# EAGLE design IOIO Homemade (EAGLE 5.11)
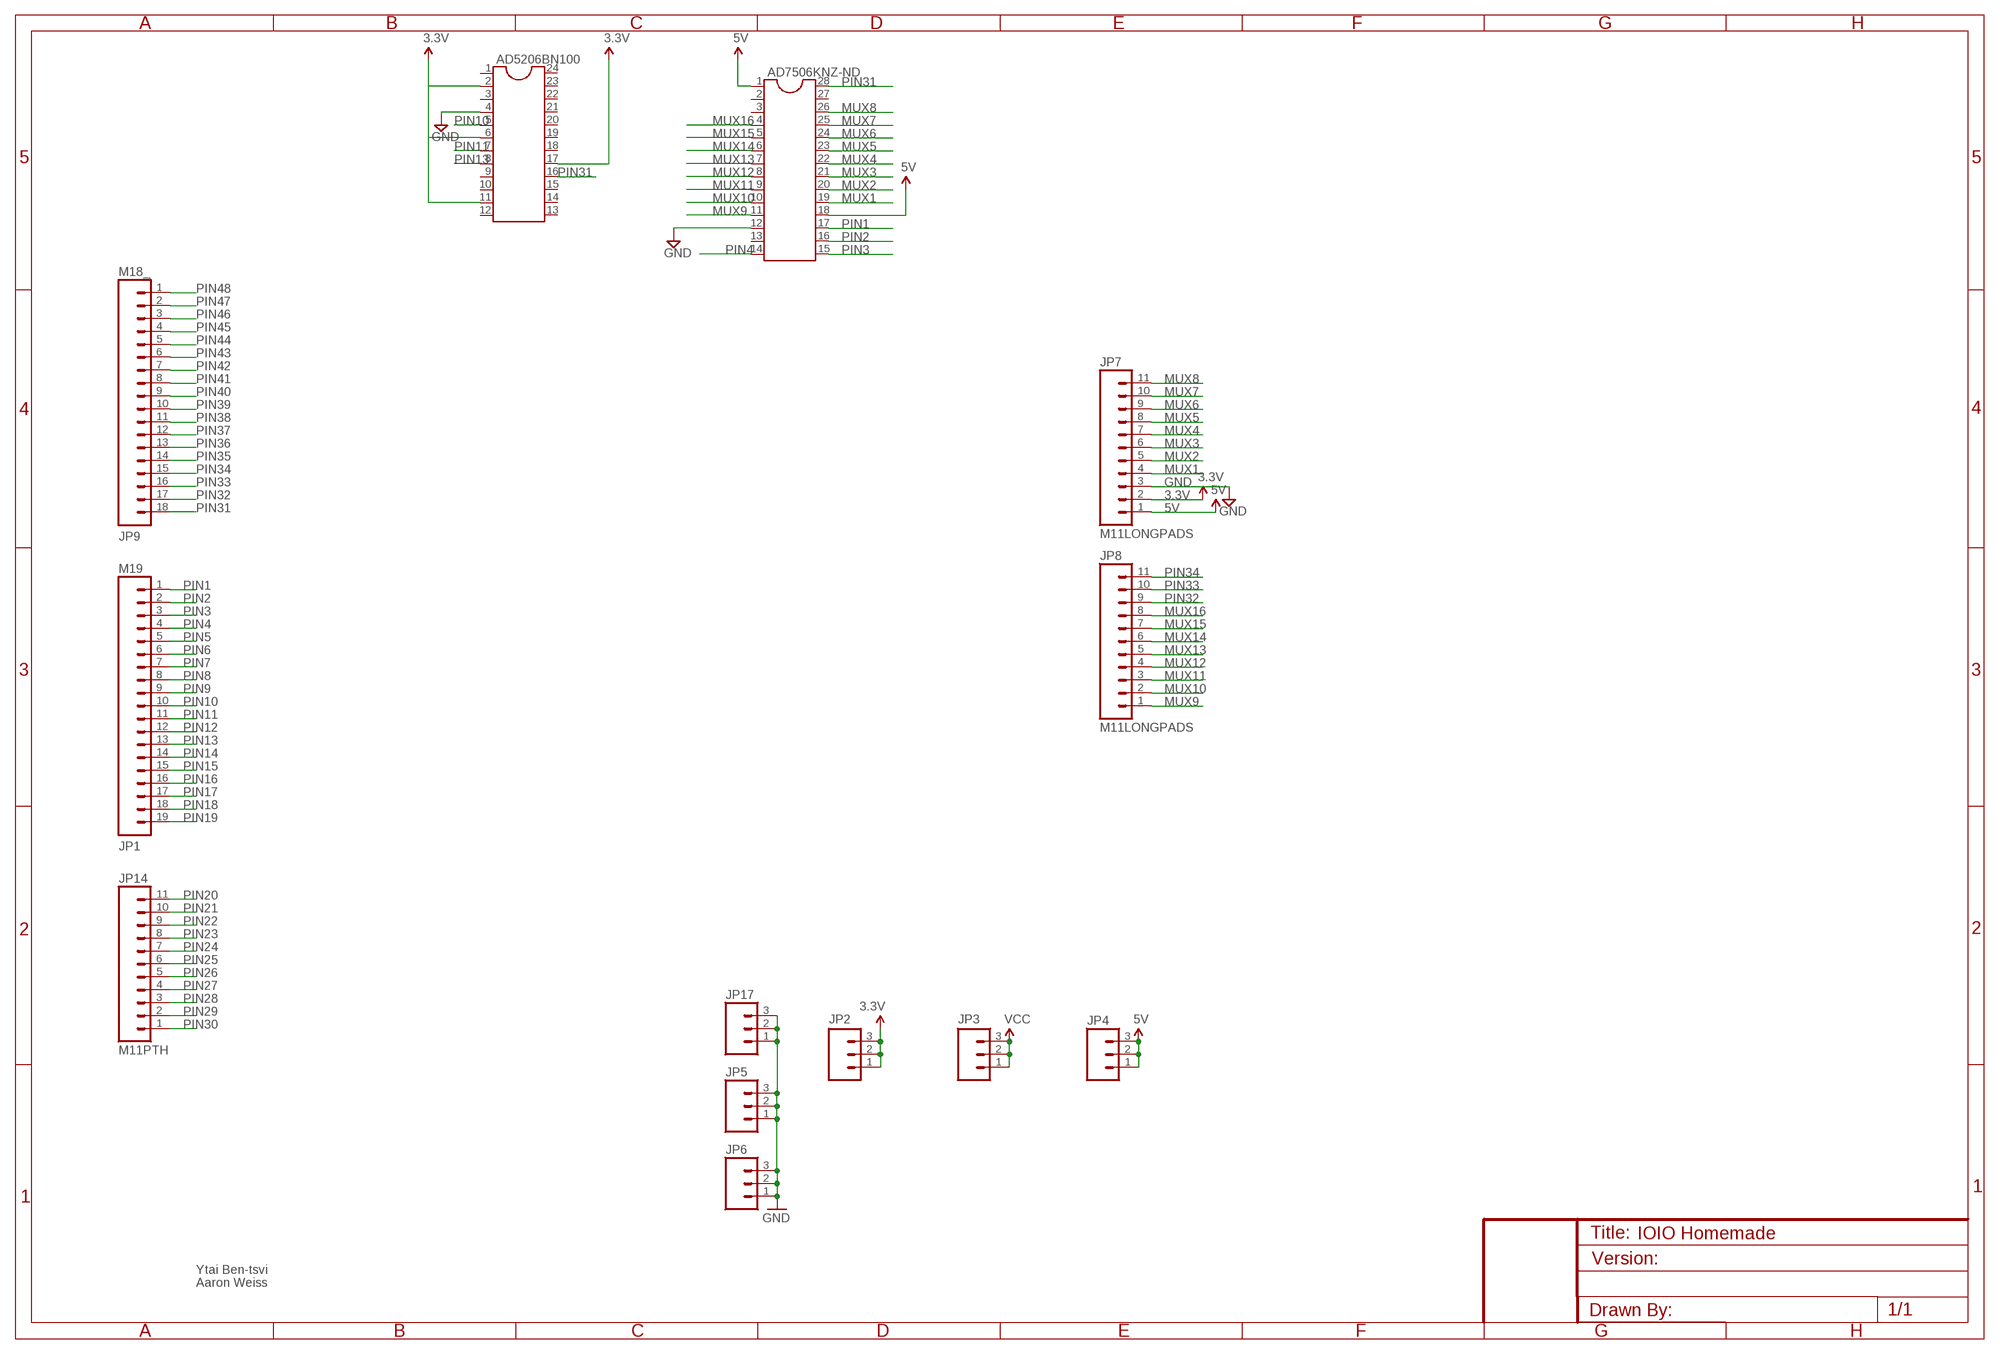
[diagram p0: schematic, sheet 1]

## Parts
AD5206BN100  DIL24-3  [DIL24-3]
AD7506KNZ-ND  DIL28  [DIL28-6]
JP1  M19  [1X19]
JP2  M03PTH  [1X03]
JP3  M03PTH  [1X03]
JP4  M03PTH  [1X03]
JP5  M03PTH  [1X03]
JP6  M03PTH  [1X03]
JP7  M11LONGPADS  [1X11_LONGPADS]
JP8  M11LONGPADS  [1X11_LONGPADS]
JP9  M18_  [1X18]
JP14  M11PTH  [1X11]
JP17  M03PTH  [1X03]

## Nets
3.3V: AD5206BN100.2 AD5206BN100.6 AD5206BN100.11 AD5206BN100.17 JP2.1 JP2.2 JP2.3 JP7.2
5V: AD7506KNZ-ND.1 AD7506KNZ-ND.18 JP4.1 JP4.2 JP4.3 JP7.1
GND: AD5206BN100.4 AD7506KNZ-ND.12 JP5.1 JP5.2 JP5.3 JP6.1 JP6.2 JP6.3 JP7.3 JP17.1 JP17.2 JP17.3
MUX1: AD7506KNZ-ND.19 JP7.4
MUX2: AD7506KNZ-ND.20 JP7.5
MUX3: AD7506KNZ-ND.21 JP7.6
MUX4: AD7506KNZ-ND.22 JP7.7
MUX5: AD7506KNZ-ND.23 JP7.8
MUX6: AD7506KNZ-ND.24 JP7.9
MUX7: AD7506KNZ-ND.25 JP7.10
MUX8: AD7506KNZ-ND.26 JP7.11
MUX9: AD7506KNZ-ND.11 JP8.1
MUX10: AD7506KNZ-ND.10 JP8.2
MUX11: AD7506KNZ-ND.9 JP8.3
MUX12: AD7506KNZ-ND.8 JP8.4
MUX13: AD7506KNZ-ND.7 JP8.5
MUX14: AD7506KNZ-ND.6 JP8.6
MUX15: AD7506KNZ-ND.5 JP8.7
MUX16: AD7506KNZ-ND.4 JP8.8
PIN1: AD7506KNZ-ND.17 JP1.1
PIN2: AD7506KNZ-ND.16 JP1.2
PIN3: AD7506KNZ-ND.15 JP1.3
PIN4: AD7506KNZ-ND.14 JP1.4
PIN5: JP1.5
PIN6: JP1.6
PIN7: JP1.7
PIN8: JP1.8
PIN9: JP1.9
PIN10: AD5206BN100.5 JP1.10
PIN11: AD5206BN100.7 JP1.11
PIN12: JP1.12
PIN13: AD5206BN100.8 JP1.13
PIN14: JP1.14
PIN15: JP1.15
PIN16: JP1.16
PIN17: JP1.17
PIN18: JP1.18
PIN19: JP1.19
PIN20: JP14.11
PIN21: JP14.10
PIN22: JP14.9
PIN23: JP14.8
PIN24: JP14.7
PIN25: JP14.6
PIN26: JP14.5
PIN27: JP14.4
PIN28: JP14.3
PIN29: JP14.2
PIN30: JP14.1
PIN31: AD5206BN100.16 AD7506KNZ-ND.28 JP9.18
PIN32: JP8.9 JP9.17
PIN33: JP8.10 JP9.16
PIN34: JP8.11 JP9.15
PIN35: JP9.14
PIN36: JP9.13
PIN37: JP9.12
PIN38: JP9.11
PIN39: JP9.10
PIN40: JP9.9
PIN41: JP9.8
PIN42: JP9.7
PIN43: JP9.6
PIN44: JP9.5
PIN45: JP9.4
PIN46: JP9.3
PIN47: JP9.2
PIN48: JP9.1
VCC: JP3.1 JP3.2 JP3.3
Unconnected: AD5206BN100.1 AD5206BN100.3 AD5206BN100.9 AD5206BN100.10 AD5206BN100.12 AD5206BN100.13 AD5206BN100.14 AD5206BN100.15 AD5206BN100.18 AD5206BN100.19 AD5206BN100.20 AD5206BN100.21 AD5206BN100.22 AD5206BN100.23 AD5206BN100.24 AD7506KNZ-ND.2 AD7506KNZ-ND.3 AD7506KNZ-ND.13 AD7506KNZ-ND.27

## Notes on the sheet
- Ytai Ben-tsvi
- Aaron Weiss

## Library data of the parts
AD5206BN100 = ic-package:DIL24: Dual In Line
AD7506KNZ-ND = ic-package:DIL28: Dual In Line
JP1 = SparkFun:M19
JP2-JP6 JP17 = SparkFun:M03: Header 3 Standard 3-pin 0.1" header. Use with straight break away headers (SKU : PRT-00116), right angle break away headers (PRT-00553), swiss pins (PRT-00743), machine pins (PRT-00117), and female headers (PRT-00115). Molex polarized connector foot print use with SKU : PRT-08232 with associated crimp pins and housings.
JP7 JP8 JP14 = SparkFun:M11: Header 11 Standard 11-pin 0.1" header. Use with straight break away headers (SKU : PRT-00116), right angle break away headers (PRT-00553), swiss pins (PRT-00743), machine pins (PRT-00117), and female headers (PRT-00115).
JP9 = SparkFun:M18

## Board
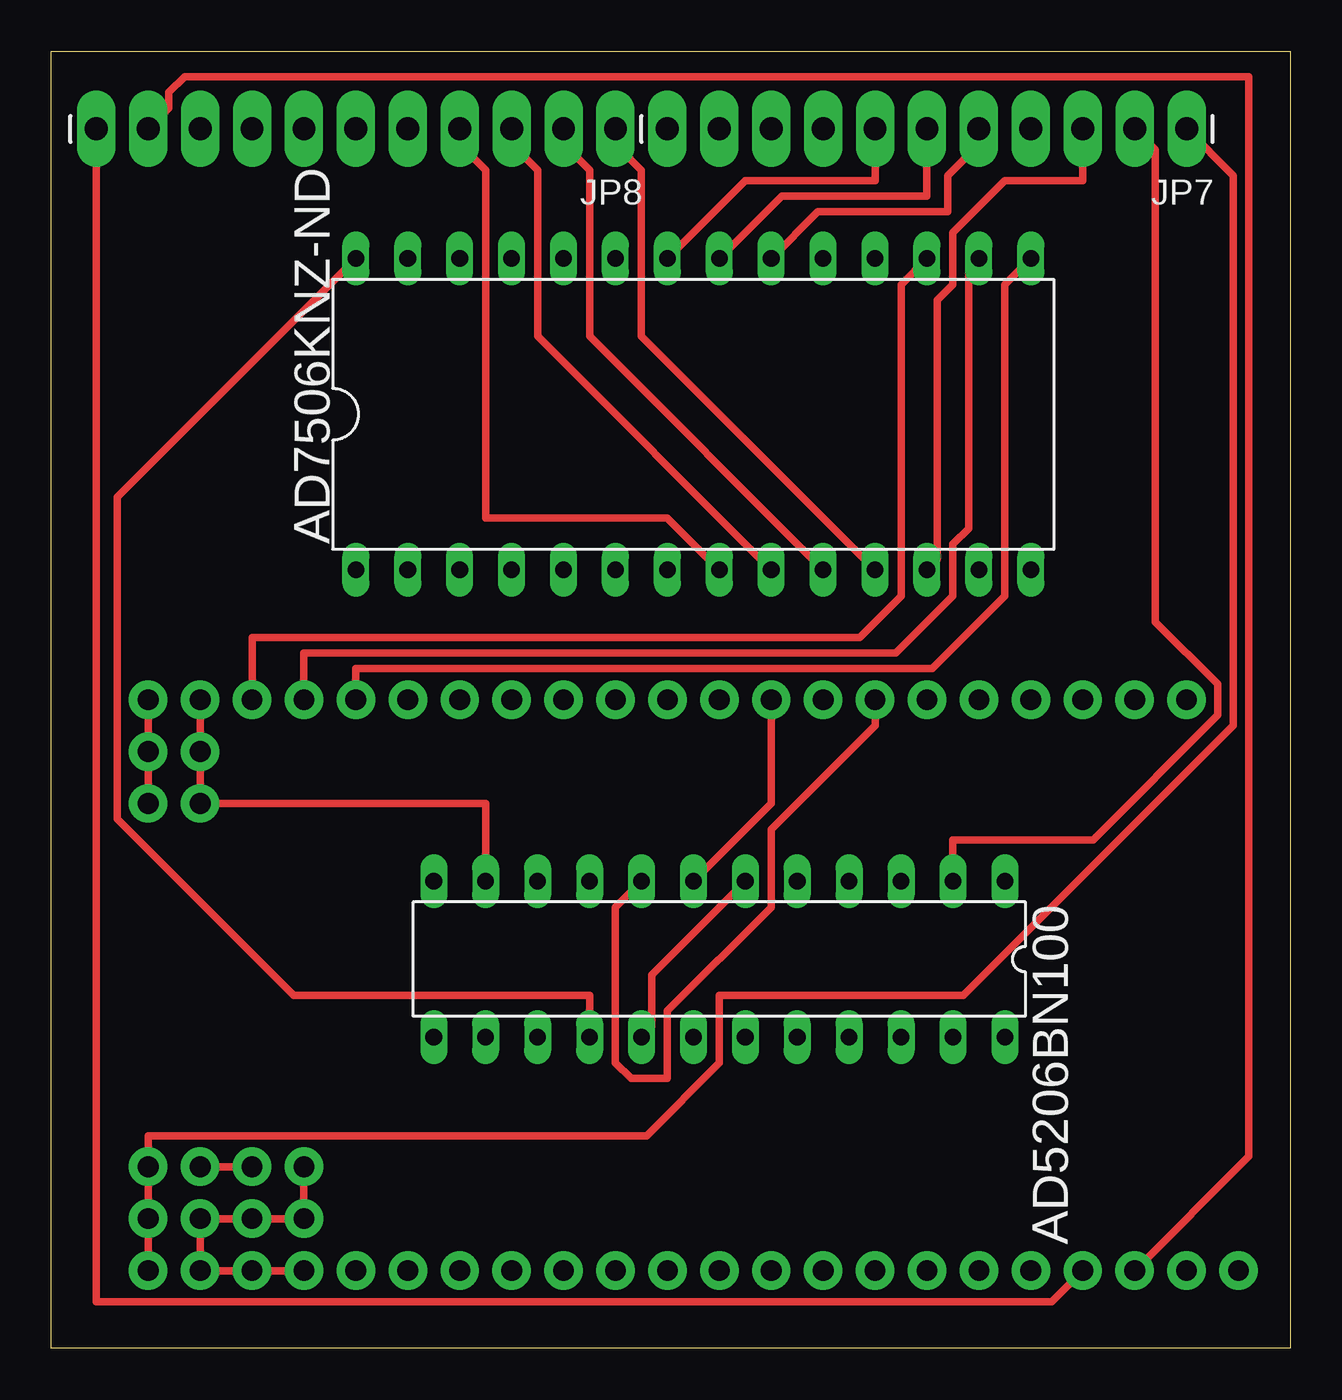
[diagram p1: board, top side]
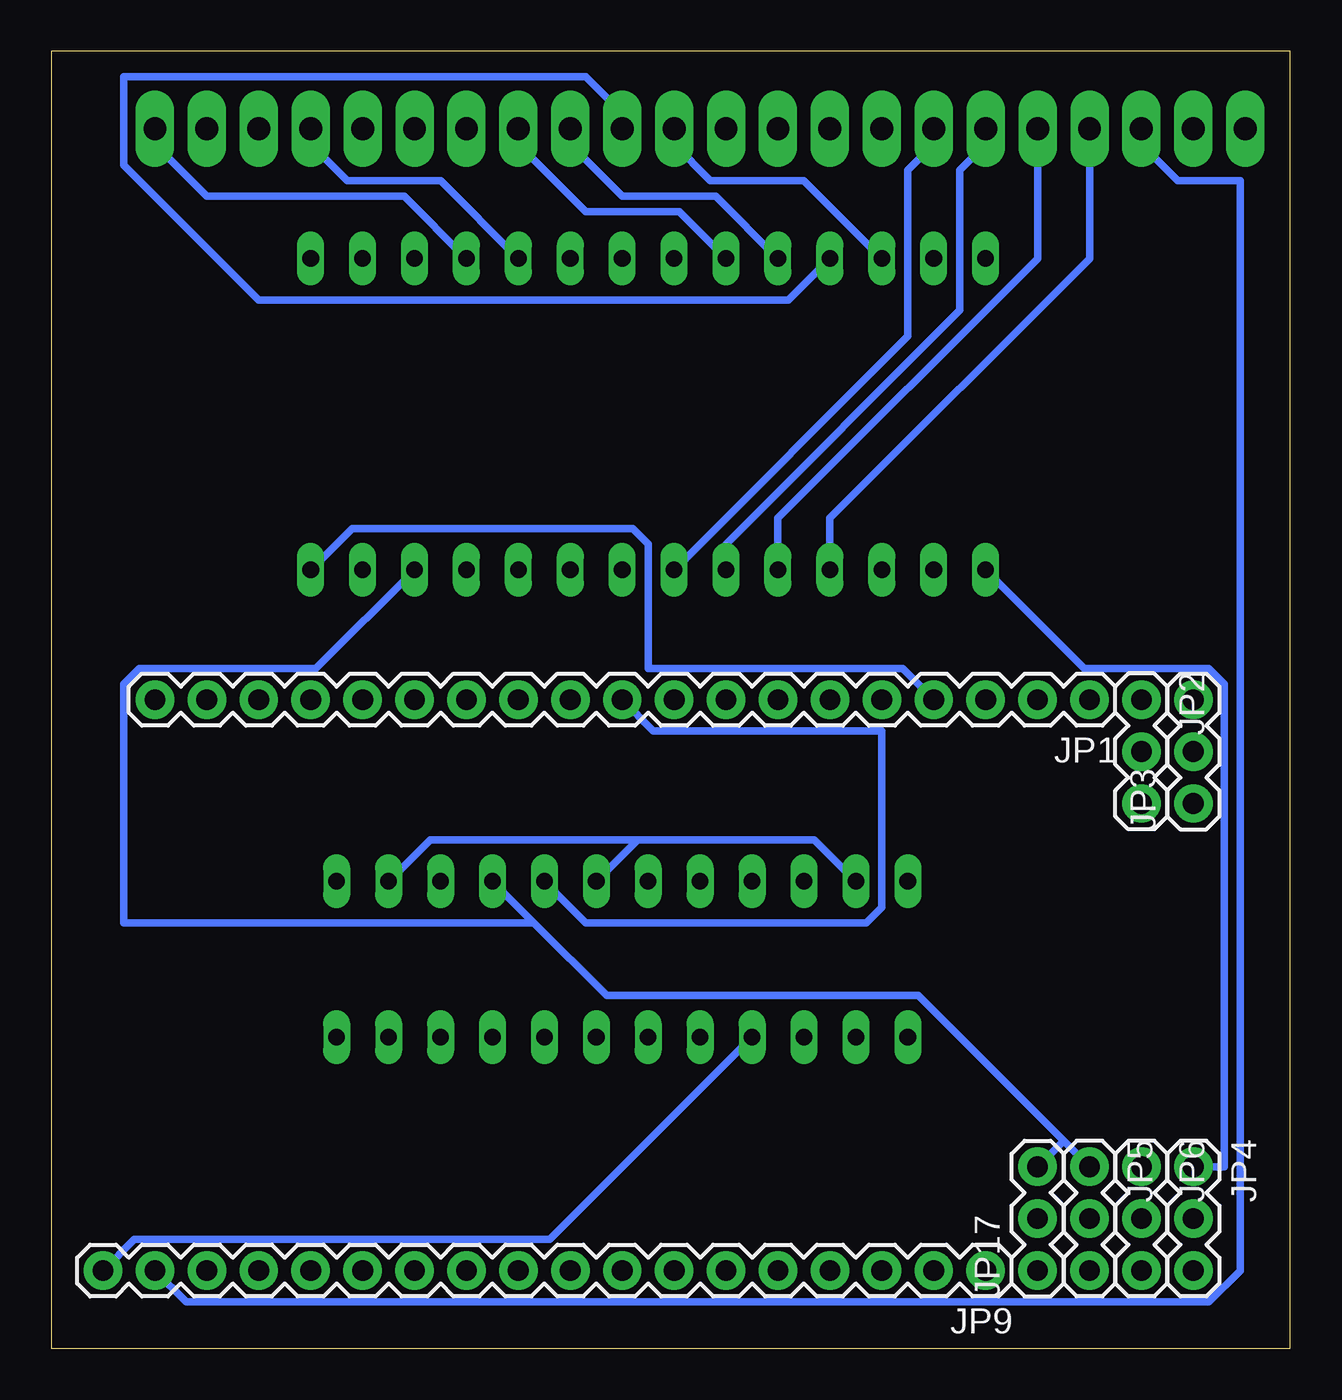
[diagram p2: board, bottom side, seen from below]

Size 60.63 x 63.49 mm. Coordinates in mm from the lower left corner, seen from the top.
Outline: 60.63,0 0,0 0,63.49 60.63,63.49 60.63,0
Copper layers (1*16): Top 0.035mm / dielectric 1.5mm / Bottom 0.035mm
Design rules "default *": minimum track width 14mil, minimum drill 24mil, track to track 16mil, track to pad 16mil, pad to pad 16mil, via to via 16mil, smd to smd 8mil, copper to edge 40mil, drill to drill 8mil, minimum pad ring 10mil, minimum via ring 8mil, stop-mask expansion 4mil, vias tented up to drill 0mil, thermal gap 10mil

### Footprints (pad centres in the part's own frame; a part is rotated, then mirrored left to right if it is on the bottom)
DIL24-3 = drill 0.813 long: 1 -13.97,-3.81; 2 -11.43,-3.81; 3 -8.89,-3.81; 4 -6.35,-3.81; 5 -3.81,-3.81; 6 -1.27,-3.81; 7 1.27,-3.81; 8 3.81,-3.81; 9 6.35,-3.81; 10 8.89,-3.81; 11 11.43,-3.81; 12 13.97,-3.81; 13 13.97,3.81; 14 11.43,3.81; 15 8.89,3.81; 16 6.35,3.81; 17 3.81,3.81; 18 1.27,3.81; 19 -1.27,3.81; 20 -3.81,3.81; 21 -6.35,3.81; 22 -8.89,3.81; 23 -11.43,3.81; 24 -13.97,3.81
DIL28-6 = drill 0.813 long: 1 -16.51,-7.62; 2 -13.97,-7.62; 3 -11.43,-7.62; 4 -8.89,-7.62; 5 -6.35,-7.62; 6 -3.81,-7.62; 7 -1.27,-7.62; 8 1.27,-7.62; 9 3.81,-7.62; 10 6.35,-7.62; 11 8.89,-7.62; 12 11.43,-7.62; 13 13.97,-7.62; 14 16.51,-7.62; 15 16.51,7.62; 16 13.97,7.62; 17 11.43,7.62; 18 8.89,7.62; 19 6.35,7.62; 20 3.81,7.62; 21 1.27,7.62; 22 -1.27,7.62; 23 -3.81,7.62; 24 -6.35,7.62; 25 -8.89,7.62; 26 -11.43,7.62; 27 -13.97,7.62; 28 -16.51,7.62
1X19 = drill 1.016 pad 1.88 round: 1 0,0; 2 2.54,0; 3 5.08,0; 4 7.62,0; 5 10.16,0; 6 12.7,0; 7 15.24,0; 8 17.78,0; 9 20.32,0; 10 22.86,0; 11 25.4,0; 12 27.94,0; 13 30.48,0; 14 33.02,0; 15 35.56,0; 16 38.1,0; 17 40.64,0; 18 43.18,0; 19 45.72,0
1X03 = drill 1.016 pad 1.88 round: 1 0,0; 2 2.54,0; 3 5.08,0
1X11_LONGPADS = drill 1.118 pad 1.88 long: 1 0,0; 2 2.54,0; 3 5.08,0; 4 7.62,0; 5 10.16,0; 6 12.7,0; 7 15.24,0; 8 17.78,0; 9 20.32,0; 10 22.86,0; 11 25.4,0
1X18 = drill 1.016 pad 1.88 round: 1 0,0; 2 2.54,0; 3 5.08,0; 4 7.62,0; 5 10.16,0; 6 12.7,0; 7 15.24,0; 8 17.78,0; 9 20.32,0; 10 22.86,0; 11 25.4,0; 12 27.94,0; 13 30.48,0; 14 33.02,0; 15 35.56,0; 16 38.1,0; 17 40.64,0; 18 43.18,0
1X11 = drill 1.016 pad 1.88 round: 1 0,0; 2 2.54,0; 3 5.08,0; 4 7.62,0; 5 10.16,0; 6 12.7,0; 7 15.24,0; 8 17.78,0; 9 20.32,0; 10 22.86,0; 11 25.4,0

### Placement (x,y rotation side)
AD5206BN100  32.69,19.05 180 top
AD7506KNZ-ND  31.42,45.72 0 top
JP1  9.83,31.75 180 bottom
JP2  7.29,31.75 270 bottom
JP3  4.75,26.67 90 bottom
JP4  4.75,8.89 270 bottom
JP5  9.83,8.89 270 bottom
JP6  7.29,8.89 270 bottom
JP7  55.55,59.69 180 top
JP8  27.61,59.69 180 top
JP9  14.91,3.81 180 bottom
JP14  97.46,5.08 90 bottom  (outside the outline)
JP17  12.37,3.81 90 bottom

### Tracks (layer width: path | path; a pad name or v marks a point on that pad's centre or on a via)
3.3V
  Top 0.356: JP2.1 JP2.2 JP2.3 21.26,26.67 AD5206BN100.11 | AD5206BN100.17 29.39,15.75 29.39,18.29 AD5206BN100.6 | JP7.2 54.03,58.67 54.03,35.56 57.07,32.51 57.07,30.99 50.98,24.89 44.12,24.89 AD5206BN100.2
  Bottom 0.356: AD5206BN100.11 23.29,24.89 31.93,24.89 | 31.93,24.89 AD5206BN100.6 | AD5206BN100.2 42.09,24.89 31.93,24.89
5V
  Top 0.356: JP4.3 JP4.2 JP4.1 4.75,10.41 29.13,10.41 32.69,13.97 32.69,17.27 44.63,17.27 57.84,30.48 57.84,57.4 JP7.1
  Bottom 0.356: AD7506KNZ-ND.18 43.36,56.39 53.01,56.39 55.55,58.93 JP7.1 | AD7506KNZ-ND.1 10.08,33.27 3.99,33.27 3.23,32.51 3.23,8.89 JP4.1
GND
  Top 0.356: AD7506KNZ-ND.12 43.36,38.61 43.36,51.31 44.12,52.07 44.12,54.61 46.66,57.15 50.47,57.15 JP7.3 | JP17.1 JP5.3 JP6.3 JP6.2 JP5.2 JP17.2 JP17.3 | JP5.1 JP6.1
  Bottom 0.356: 37.01,20.83 33.45,17.27 18.21,17.27 11.1,10.16 | 37.01,20.83 AD5206BN100.4 | 11.1,10.16 JP5.1 | JP17.3 11.1,10.16 | AD7506KNZ-ND.12 47.68,33.27 56.31,33.27 57.07,32.51 57.07,20.83 37.01,20.83
MUX1
  Bottom 0.356: AD7506KNZ-ND.19 41.58,57.15 46.15,57.15 47.93,58.93 JP7.4
MUX2
  Top 0.356: AD7506KNZ-ND.20 37.52,55.63 43.87,55.63 43.87,57.4 45.39,58.93 JP7.5
MUX3
  Top 0.356: AD7506KNZ-ND.21 35.74,56.39 42.85,56.39 JP7.6
MUX4
  Top 0.356: AD7506KNZ-ND.22 33.96,57.15 40.31,57.15 JP7.7
MUX5
  Bottom 0.356: AD7506KNZ-ND.23 29.9,55.63 34.47,55.63 37.77,58.93 JP7.8
MUX6
  Bottom 0.356: AD7506KNZ-ND.24 28.12,56.39 32.69,56.39 35.23,58.93 JP7.9
MUX7
  Bottom 0.356: AD7506KNZ-ND.25 24.56,51.31 50.47,51.31 57.07,57.91 57.07,62.23 34.47,62.23 32.69,60.45 JP7.10
MUX8
  Bottom 0.356: AD7506KNZ-ND.26 23.8,57.15 28.37,57.15 30.15,58.93 JP7.11
MUX9
  Top 0.356: AD7506KNZ-ND.11 28.88,49.53 28.88,57.66 27.61,58.93 JP8.1
MUX10
  Top 0.356: AD7506KNZ-ND.10 26.34,49.53 26.34,57.66 25.07,58.93 JP8.2
MUX11
  Top 0.356: AD7506KNZ-ND.9 23.8,49.53 23.8,57.66 22.53,58.93 JP8.3
MUX12
  Top 0.356: AD7506KNZ-ND.8 30.15,40.64 21.26,40.64 21.26,57.66 19.99,58.93 JP8.4
MUX13
  Bottom 0.356: AD7506KNZ-ND.7 18.72,49.53 18.72,57.66 17.45,58.93 JP8.5
MUX14
  Bottom 0.356: AD7506KNZ-ND.6 27.61,39.37 16.18,50.8 16.18,57.66 14.91,58.93 JP8.6
MUX15
  Bottom 0.356: AD7506KNZ-ND.5 25.07,40.64 12.37,53.34 JP8.7
MUX16
  Bottom 0.356: AD7506KNZ-ND.4 22.53,40.64 9.83,53.34 JP8.8
PIN1
  Top 0.356: AD7506KNZ-ND.17 41.58,52.07 41.58,36.83 39.55,34.8 9.83,34.8 JP1.1
PIN2
  Top 0.356: AD7506KNZ-ND.16 44.88,52.83 44.88,40.13 44.12,39.37 44.12,36.83 41.33,34.04 12.37,34.04 JP1.2
PIN3
  Top 0.356: AD7506KNZ-ND.15 46.66,52.07 46.66,36.83 43.1,33.27 14.91,33.27 JP1.3
PIN4
  Bottom 0.356: AD7506KNZ-ND.14 45.9,40.13 32.18,40.13 31.42,39.37 31.42,33.27 18.97,33.27 JP1.4
PIN10
  Bottom 0.356: AD5206BN100.5 34.47,20.83 20.75,20.83 19.99,21.59 19.99,30.23 31.17,30.23 JP1.10
PIN11
  Top 0.356: AD5206BN100.7 35.23,26.67 JP1.11
PIN13
  Top 0.356: AD5206BN100.8 27.61,21.59 27.61,13.97 28.37,13.21 30.15,13.21 30.15,16.51 35.23,21.59 35.23,25.4 40.31,30.48 JP1.13
PIN31
  Top 0.356: AD7506KNZ-ND.28 3.23,41.66 3.23,25.91 11.86,17.27 26.34,17.27 AD5206BN100.16
  Bottom 0.356: AD5206BN100.16 36.25,5.33 56.57,5.33 JP9.18
PIN32
  Bottom 0.356: JP9.17 54.03,2.29 3.99,2.29 2.46,3.81 2.46,57.15 5.51,57.15 7.29,58.93 JP8.9
PIN33
  Top 0.356: JP8.10 5.77,60.71 5.77,61.47 6.53,62.23 58.6,62.23 58.6,9.4 JP9.16
PIN34
  Top 0.356: JP9.15 48.95,2.29 2.21,2.29 JP8.11
VCC
  Top 0.356: JP3.1 JP3.2 JP3.3